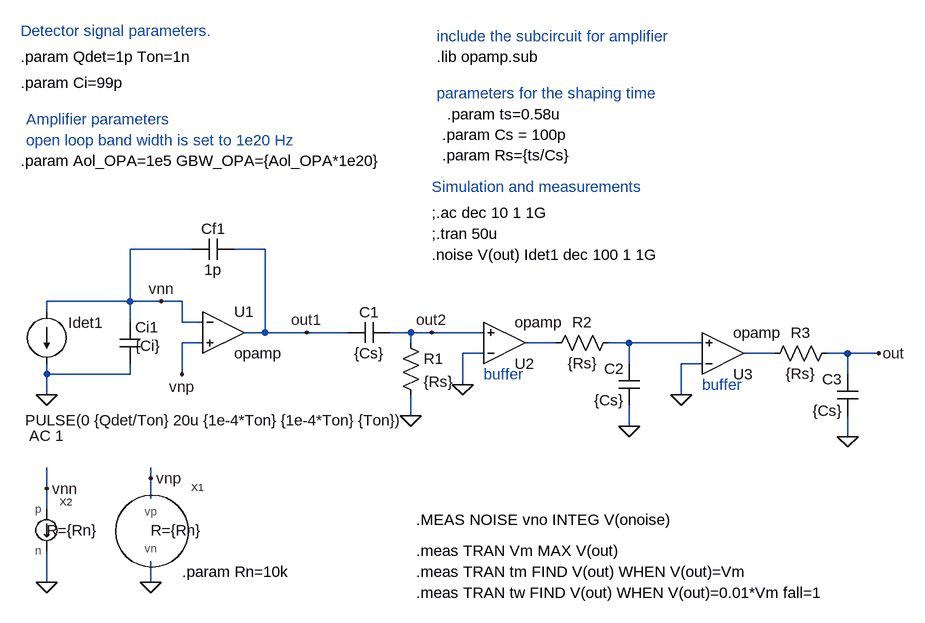
[diagram p0: schematic 03_CSA_CRRC2_Noise.asc]
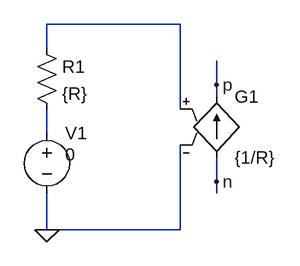
[diagram p1: sub-circuit inoise.asc]
03_CSA_CRRC2_Noise.asc, the LTspice schematic file:
Version 4
SHEET 1 1016 680
WIRE -96 -48 -192 -48
WIRE 16 -48 -32 -48
WIRE -192 32 -192 -48
WIRE -192 32 -320 32
WIRE -144 32 -192 32
WIRE -112 32 -144 32
WIRE -320 48 -320 32
WIRE -192 64 -192 32
WIRE -112 64 -112 32
WIRE -80 64 -112 64
WIRE 16 80 16 -48
WIRE 16 80 -16 80
WIRE 80 80 16 80
WIRE 144 80 80 80
WIRE 240 80 208 80
WIRE 272 80 240 80
WIRE 352 80 272 80
WIRE -80 96 -112 96
WIRE 240 96 240 80
WIRE 464 96 416 96
WIRE 576 96 544 96
WIRE 688 96 576 96
WIRE 352 112 320 112
WIRE 800 112 752 112
WIRE 912 112 880 112
WIRE 960 112 912 112
WIRE 576 128 576 96
WIRE 688 128 656 128
WIRE -320 144 -320 128
WIRE -192 144 -192 128
WIRE -192 144 -320 144
WIRE -112 144 -112 96
WIRE 912 144 912 112
WIRE 320 160 320 112
WIRE -320 176 -320 144
WIRE 656 176 656 128
WIRE 240 208 240 176
WIRE 576 224 576 192
WIRE 912 240 912 208
WIRE -160 304 -160 288
WIRE -320 320 -320 288
WIRE -160 336 -160 304
WIRE -320 352 -320 320
WIRE -320 464 -320 416
WIRE -160 464 -160 432
FLAG -320 176 0
FLAG -160 464 0
FLAG -320 464 0
FLAG -112 144 vnp
FLAG -160 304 vnp
FLAG -320 320 vnn
FLAG -144 32 vnn
FLAG 240 208 0
FLAG 320 160 0
FLAG 576 224 0
FLAG 80 80 out1
FLAG 272 80 out2
FLAG 656 176 0
FLAG 912 240 0
FLAG 960 112 out
SYMBOL cap -208 64 R0
WINDOW 3 24 36 Left 2
SYMATTR Value {Ci}
SYMATTR InstName Ci1
SYMBOL cap -32 -64 R90
WINDOW 0 0 32 VBottom 2
WINDOW 3 32 32 VTop 2
SYMATTR InstName Cf1
SYMATTR Value 1p
SYMBOL Opamps\\opamp -48 16 R0
SYMATTR InstName U1
SYMATTR SpiceLine Aol={Aol_OPA}
SYMATTR SpiceLine2 GBW={GBW_OPA}
SYMBOL current -320 48 R0
WINDOW 0 33 17 Left 2
WINDOW 123 -27 191 Left 2
WINDOW 39 0 0 Left 2
WINDOW 3 -33 167 Left 2
SYMATTR InstName Idet1
SYMATTR Value2 AC 1
SYMATTR Value PULSE(0 {Qdet/Ton} 20u {1e-4*Ton} {1e-4*Ton} {Ton})
SYMBOL vnoise -160 384 R0
WINDOW 39 0 0 Left 2
SYMATTR SpiceLine R={Rn}
SYMATTR InstName X1
SYMBOL inoise -320 384 R0
WINDOW 39 0 0 Left 2
SYMATTR SpiceLine R={Rn}
SYMATTR InstName X2
SYMBOL Opamps\\opamp 384 160 M180
SYMATTR InstName U2
SYMATTR SpiceLine Aol=1
SYMATTR SpiceLine2 GBW=10G
SYMBOL cap 208 64 R90
WINDOW 0 0 32 VBottom 2
WINDOW 3 32 32 VTop 2
SYMATTR InstName C1
SYMATTR Value {Cs}
SYMBOL cap 592 192 R180
WINDOW 0 24 56 Left 2
WINDOW 3 24 8 Left 2
SYMATTR InstName C2
SYMATTR Value {Cs}
SYMBOL res 224 80 R0
SYMATTR InstName R1
SYMATTR Value {Rs}
SYMBOL res 560 80 R90
WINDOW 0 0 56 VBottom 2
WINDOW 3 32 56 VTop 2
SYMATTR InstName R2
SYMATTR Value {Rs}
SYMBOL Opamps\\opamp 720 176 M180
SYMATTR InstName U3
SYMATTR SpiceLine Aol=1
SYMATTR SpiceLine2 GBW=10G
SYMBOL cap 928 208 R180
WINDOW 0 24 56 Left 2
WINDOW 3 24 8 Left 2
SYMATTR InstName C3
SYMATTR Value {Cs}
SYMBOL res 896 96 R90
WINDOW 0 0 56 VBottom 2
WINDOW 3 32 56 VTop 2
SYMATTR InstName R3
SYMATTR Value {Rs}
TEXT -360 -344 Left 2 !.param Qdet=1p Ton=1n
TEXT -360 -184 Left 2 !.param Aol_OPA=1e5 GBW_OPA={Aol_OPA*1e20}
TEXT 272 -72 Left 2 !;.tran 50u
TEXT 280 -344 Left 2 !.lib opamp.sub
TEXT -360 -304 Left 2 !.param Ci=99p
TEXT -360 -384 Left 2 ;Detector signal parameters.
TEXT 280 -376 Left 2 ;include the subcircuit for amplifier
TEXT 272 -104 Left 2 !;.ac dec 10 1 1G
TEXT 272 -144 Left 2 ;Simulation and measurements
TEXT -352 -248 Left 2 ;Amplifier parameters
TEXT -352 -216 Left 2 ;open loop band width is set to 1e20 Hz
TEXT 272 -40 Left 2 !.noise V(out) Idet1 dec 100 1 1G
TEXT -112 448 Left 2 !.param Rn=10k
TEXT 352 144 Left 2 ;buffer
TEXT 280 -288 Left 2 ;parameters for the shaping time
TEXT 288 -224 Left 2 !.param Cs = 100p\n.param Rs={ts/Cs}
TEXT 248 368 Left 2 !.MEAS NOISE vno INTEG V(onoise)
TEXT 296 -256 Left 2 !.param ts=0.58u
TEXT 248 416 Left 2 !.meas TRAN Vm MAX V(out)
TEXT 248 448 Left 2 !.meas TRAN tm FIND V(out) WHEN V(out)=Vm
TEXT 248 480 Left 2 !.meas TRAN tw FIND V(out) WHEN V(out)=0.01*Vm fall=1
TEXT 688 160 Left 2 ;buffer

inoise.asc, the sub-circuit schematic file:
Version 4
SHEET 1 880 680
WIRE 352 64 176 64
WIRE 176 96 176 64
WIRE 400 144 400 112
WIRE 400 160 400 144
WIRE 352 176 352 64
WIRE 176 208 176 176
WIRE 400 272 400 240
WIRE 400 288 400 272
WIRE 176 336 176 288
WIRE 352 336 352 224
WIRE 352 336 176 336
FLAG 400 144 p
FLAG 400 272 n
FLAG 176 336 0
SYMBOL res 160 80 R0
SYMATTR InstName R1
SYMATTR Value {R}
SYMBOL voltage 176 192 R0
WINDOW 123 0 0 Left 2
WINDOW 39 0 0 Left 2
WINDOW 3 24 44 Left 2
SYMATTR InstName V1
SYMATTR Value 0
SYMBOL g 400 144 R0
SYMATTR InstName G1
SYMATTR Value {1/R}

The netlist it stands for:
* 03_CSA_CRRC2_Noise.asc
Ci1 vnn 0 {Ci}
Cf1 out1 vnn 1p
XU1 vnn vnp out1 opamp Aol={Aol_OPA} GBW={GBW_OPA}  ; pins invin noninvin out
Idet1 vnn 0 PULSE(0 {Qdet/Ton} 20u {1e-4*Ton} {1e-4*Ton} {Ton}) AC 1
XX1 vnp 0 vnoise params: R={Rn}  ; pins vp vn
XX2 vnn 0 inoise params: R={Rn}
XU2 0 out2 N001 opamp Aol=1 GBW=10G  ; pins invin noninvin out
C1 out2 out1 {Cs}
C2 0 N002 {Cs}
R1 out2 0 {Rs}
R2 N002 N001 {Rs}
XU3 0 N002 N003 opamp Aol=1 GBW=10G  ; pins invin noninvin out
C3 0 out {Cs}
R3 out N003 {Rs}

* block symbol definitions
.subckt inoise p n
R1 N001 N002 {R}
V1 N002 0 0
G1 n p N001 0 {1/R}
.ends inoise

.param Qdet=1p Ton=1n
.param Aol_OPA=1e5 GBW_OPA={Aol_OPA*1e20}
;.tran 50u
.lib opamp.sub
.param Ci=99p
* Detector signal parameters.
* include the subcircuit for amplifier
;.ac dec 10 1 1G
* Simulation and measurements
* Amplifier parameters
* open loop band width is set to 1e20 Hz
.noise V(out) Idet1 dec 100 1 1G
.param Rn=10k
* buffer
* parameters for the shaping time
.param Cs = 100p
.param Rs={ts/Cs}
.MEAS NOISE vno INTEG V(onoise)
.param ts=0.58u
.meas TRAN Vm MAX V(out)
.meas TRAN tm FIND V(out) WHEN V(out)=Vm
.meas TRAN tw FIND V(out) WHEN V(out)=0.01*Vm fall=1
* buffer
.backanno
.end